# Altium schematic sheet EPS_Battery_Controller_Diode.SchDoc: Battery / Controller / Ideal Diode
size A4
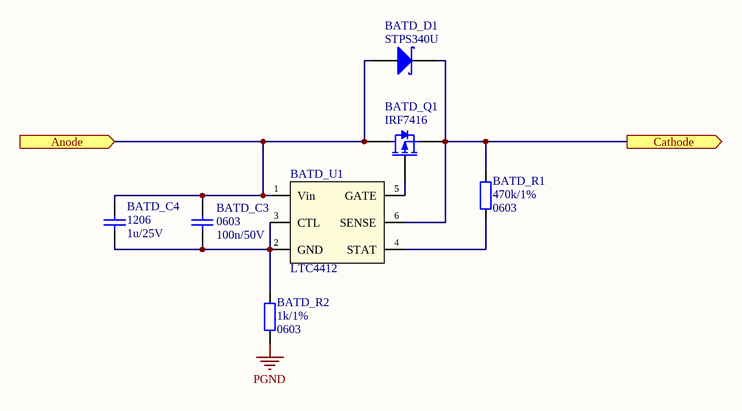
[diagram p0: EPS_Battery_Controller_Diode.SchDoc]

## Parts
BATD_C3  Package: 0603  [SMD_Capacitor_0603]  (hidden comment: 100n/50V)
BATD_C4  Package: 1206  [SMD_Capacitor_1206]  (hidden comment: 1u/25V)
BATD_D1  STPS340U  [DO-214AA]
BATD_Q1  IRF7416  [SOIC-8-N_SSSGDDDD]
BATD_R1  Package: 0603  [SMD_Resistor_0603]  (hidden comment: 470k/1%)
BATD_R2  Package: 0603  [SMD_Resistor_0603]  (hidden comment: 1k/1%)
BATD_U1  LTC4412  [SOT23-6]

## Ports
Anode (in), Cathode (out)

## Nets
PGND: BATD_R2.2
Anode: BATD_C3.1 BATD_C4.1 BATD_D1.A BATD_Q1.D BATD_U1.1(Vin) ; port Anode
Cathode: BATD_D1.K BATD_Q1.S BATD_R1.1 BATD_U1.6(SENSE) ; port Cathode
NetBATD_C3_2: BATD_C3.2 BATD_C4.2 BATD_R2.1 BATD_U1.2(GND) BATD_U1.3(CTL)
NetBATD_Q1_G: BATD_Q1.G BATD_U1.5(GATE)
NetBATD_R1_2: BATD_R1.2 BATD_U1.4(STAT)

## Notes on the sheet
- Title:
- Project:
- Author:
- Model:
- Document Number:
- Checked by:
- Rev:
- Date:
- Approved by:
- Sheet:
- of
- File name:

## Library data of the parts
BATD_C3 = Cer_GCJ188R71H104KA12D: Ceramic Cap Murata Automotive 100n/50V X7R 0603; Manufacturer: Murata; ManufacturerPartNumber: GCJ188R71H104KA12D; Value: 100n/50V
BATD_C4 = Cer_C1206T105K3RALTU: Ceramic Cap Kemet COTS 1u/25V X7R 1206; ManufacturerPartNumber: C1206T105K3RALTU; Manufacturer: Kemet; Value: 1u/25V
BATD_D1 = STPS340x: 3A/40V Power Schottky Rectifier.; Manufacturer: STMicroelectronics; Value: STPS340U
BATD_Q1 = IRF7416: 10A/30V HEXFET Power P-MOSFET.; Manufacturer: International Rectifier; Value: IRF7416
BATD_R1 BATD_R2 = Res
  BATD_R1: Value: 470k/1%
  BATD_R2: Value: 1k/1%
BATD_U1 = LTC4412: Ideal Diode, Low Loss PowerPath Controller.; Manufacturer: Linear Technology; Value: LTC4412